# EAGLE design untitled (EAGLE 9.6.0)
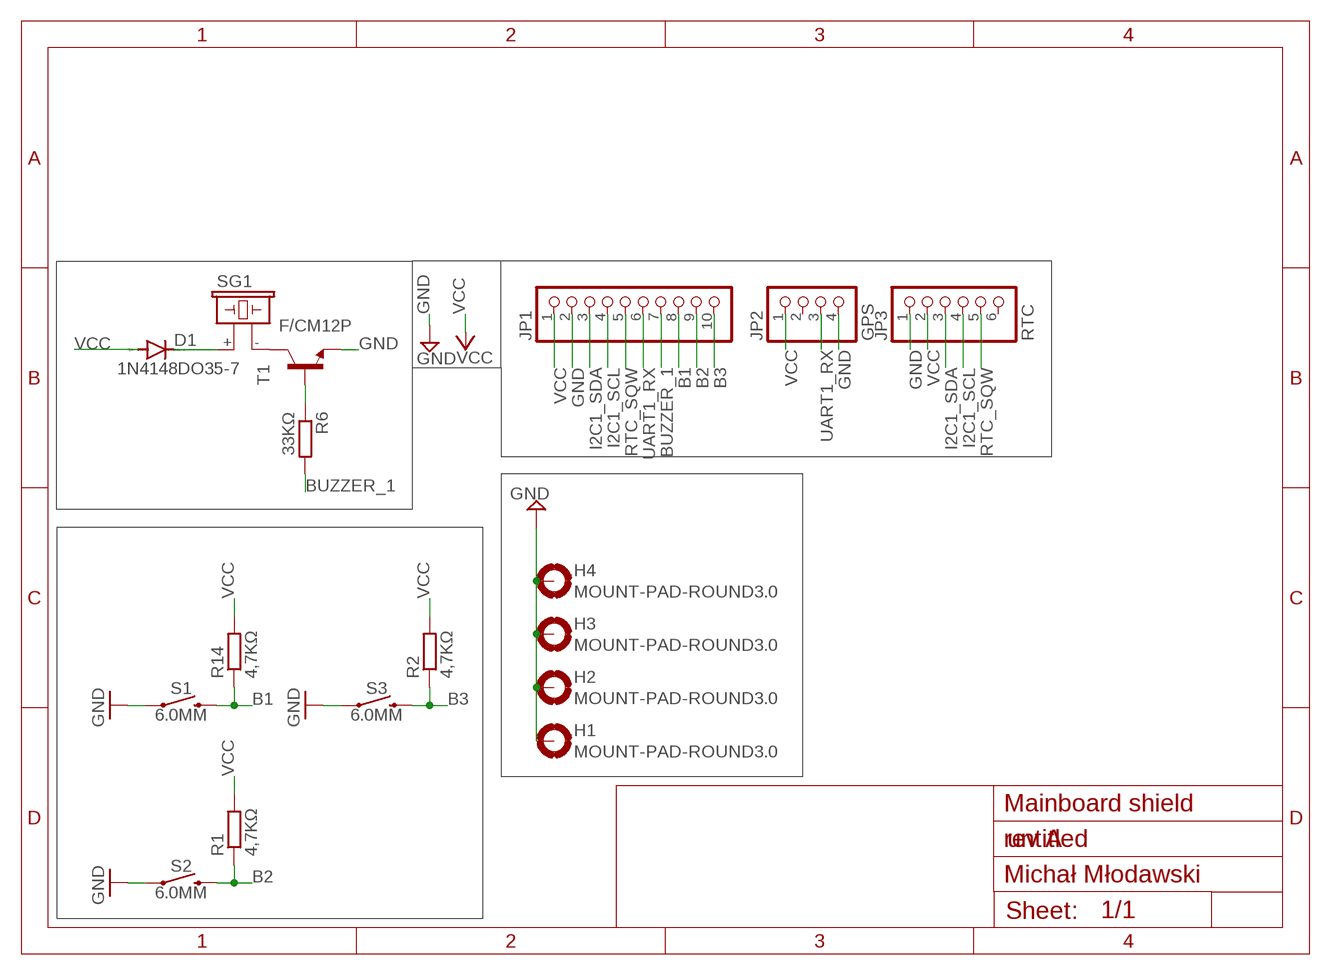
[diagram p0: schematic, sheet 1]

## Parts
D1  1N4148DO35-7  [DO35-7]
H1  MOUNT-PAD-ROUND3.0  [3,0-PAD]
H2  MOUNT-PAD-ROUND3.0  [3,0-PAD]
H3  MOUNT-PAD-ROUND3.0  [3,0-PAD]
H4  MOUNT-PAD-ROUND3.0  [3,0-PAD]
JP1  PINHD-1X10  [1X10]
JP2  GPS  PINHD-1X4  [1X04]
JP3  RTC  PINHD-1X6  [1X06]
R1  4,7KΩ  R-EU_R1206  [R1206]
R2  4,7KΩ  R-EU_R1206  [R1206]
R6  33KΩ  R-EU_R1206  [R1206]
R14  4,7KΩ  R-EU_R1206  [R1206]
S1  6.0MM  MOMENTARY-SWITCH-SPST-PTH-6.0MM  [TACTILE_SWITCH_PTH_6.0MM]
S2  6.0MM  MOMENTARY-SWITCH-SPST-PTH-6.0MM  [TACTILE_SWITCH_PTH_6.0MM]
S3  6.0MM  MOMENTARY-SWITCH-SPST-PTH-6.0MM  [TACTILE_SWITCH_PTH_6.0MM]
SG1  F/CM12P  [F/CM12P]
T1  BC548-NPN-TO92-CBE  [TO92-CBE]

## Nets
B1: JP1.8 R14.1 S1.3
B2: JP1.9 R1.1 S2.3
B3: JP1.10 R2.1 S3.3
BUZZER_1: JP1.7 R6.2
GND: H1.B3,0(MOUNT) H2.B3,0(MOUNT) H3.B3,0(MOUNT) H4.B3,0(MOUNT) JP1.2 JP2.4 JP3.1 S1.1 S2.1 S3.1 T1.E
I2C1_SCL: JP1.4 JP3.4
I2C1_SDA: JP1.3 JP3.3
N$2: D1.C SG1.+
N$3: SG1.- T1.C
N$4: R6.1 T1.B
RTC_SQW: JP1.5 JP3.5
UART1_RX: JP1.6 JP2.3
VCC: D1.A JP1.1 JP2.1 JP3.2 R1.2 R2.2 R14.2
Unconnected: JP2.2 JP3.6

## Notes on the sheet
- Mainboard shield
- rev A
- Michał Młodawski

## Library data of the parts
D1 = diode:1N4148: DIODE high speed (Philips)
H1-H4 = holes:MOUNT-PAD-ROUND: MOUNTING PAD, round
JP1 = pinhead:PINHD-1X10: PIN HEADER
JP2 = pinhead:PINHD-1X4: PIN HEADER
JP3 = pinhead:PINHD-1X6: PIN HEADER
R1 R2 R6 R14 = rcl:R-EU_: RESISTOR, European symbol; SPICEPREFIX: R
S1-S3 = SparkFun-Switches:MOMENTARY-SWITCH-SPST: Momentary Switch (Pushbutton) - SPST Normally-open (NO) SPST momentary switches (buttons, pushbuttons). Variants PTH-12MM - 12mm square, through-hole Momentary Pushbutton Switch - 12mm Square <https://www.sparkfun.com/products/9190> (COM-09190) PTH-6.0MM, PTH-6.0MM-KIT - 6.0mm square, through-hole Mini Pushbutton Switch <https://www.sparkfun.com/products/97> (COM-00097) KIT package intended for soldering kit's - only one side of pads' copper is exposed. PTH-RIGHT-ANGLE-KIT - Right-angle, through-hole Right Angle Tactile Button <https://www.sparkfun.com/products/10791> - Used on SparkFun BigTime Watch Kit <https://www.sparkfun.com/products/11734> SMD-12MM - 12mm square, surface-mount Tactile Button - SMD (12mm) <https://www.sparkfun.com/products/12993> (COM-12993) Used on SparkFun PicoBoard <https://www.sparkfun.com/products/11888> SMD-4.5MM - 4.5mm Square Trackball Switch Used on SparkFun Blackberry Trackballer Breakout <https://www.sparkfun.com/products/13169> SMD-4.6MMX2.8MM - 4.60mm x 2.80mm, surface mount Used on SparkFun SAMD21 Mini Breakout <https://www.sparkfun.com/products/13664> SMD-5.2MM, SMD-5.2-REDUNDANT - 5.2mm square, surface-mount Mini Pushbutton Switch - SMD <https://www.sparkfun.com/products/8720> (COM-08720) Used on Arduino Pro Mini <https://www.sparkfun.com/products/11114> REDUNDANT package connects both switch circuits together SMD-6.0X3.5MM - 6.0 x 3.5mm, surface mount Momentary Reset Switch SMD <https://www.sparkfun.com/products/8229> (COM-08229) SMD-6.2MM-TALL - 6.2mm square, surface mount Tactile Button - SMD (6mm) <https://www.sparkfun.com/products/12992> Used on SparkFun Digital Sandbox <https://www.sparkfun.com/products/12651> SMD-RIGHT-ANGLE - Right-angle, surface mount Used on SparkFun Block for Intel® Edison - Arduino <https://www.sparkfun.com/products/13036>; PROD_ID: SWCH-08441; SF_SKU: COM-00097
SG1 = buzzer:F/CM12P: BUZZER Source: Buerklin; OC_FARNELL: unknown; OC_NEWARK: unknown
T1 = transistor:*-NPN-: NPN Transistror BF959 corrected 2008.03.06

## Board
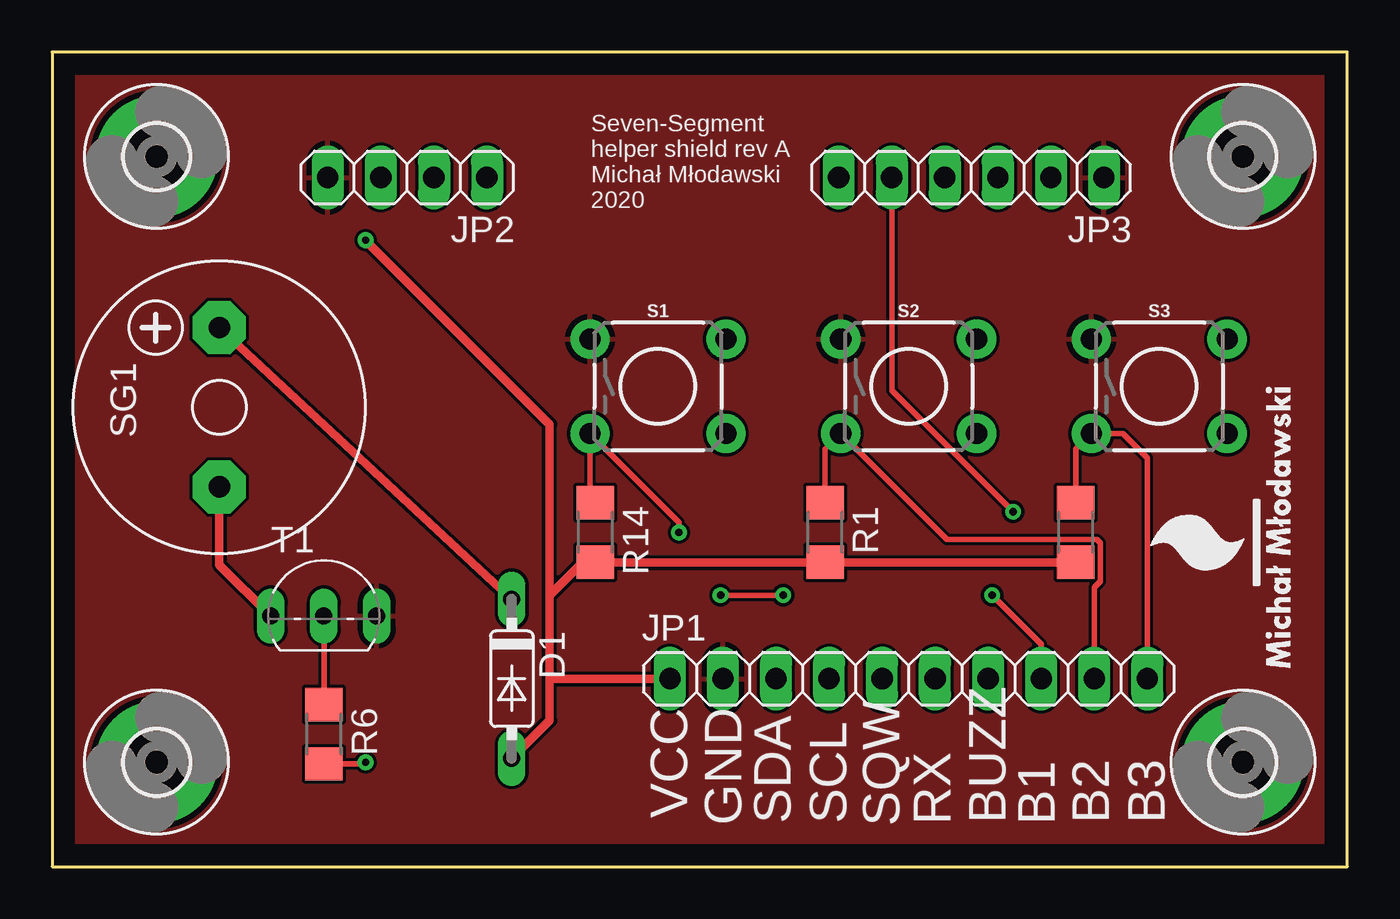
[diagram p1: board, top side]
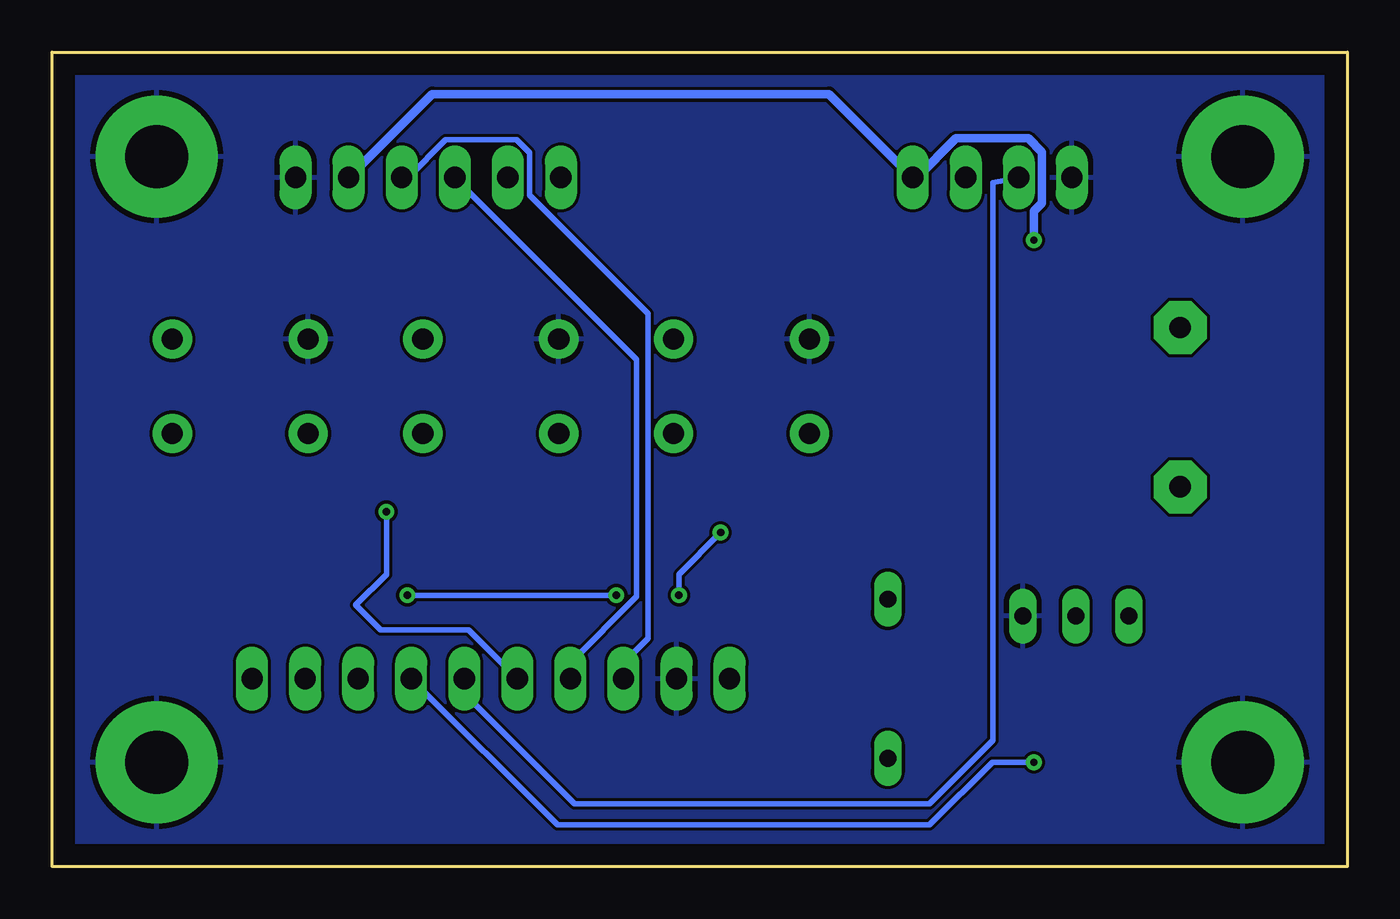
[diagram p2: board, bottom side, seen from below]

Size 62 x 39 mm. Coordinates in mm from the lower left corner, seen from the top.
Outline: 0,39 0,0 62,0 62,39 0,39
Copper layers (1*16): Top 0.035mm / dielectric 1.5mm / Bottom 0.035mm
Design rules "default": minimum track width 6mil, minimum drill 0.35mm, track to track 6mil, track to pad 6mil, pad to pad 6mil, via to via 6mil, smd to smd 6mil, copper to edge 40mil, drill to drill 6mil, minimum pad ring 10mil, minimum via ring 8mil, stop-mask expansion 4mil, vias tented up to drill 0mil, thermal gap 10mil

### Footprints (pad centres in the part's own frame; a part is rotated, then mirrored left to right if it is on the bottom)
DO35-7 = drill 0.813 long: A 3.81,0; C -3.81,0
3,0-PAD = drill 3 pad 5.842: B3,0 0,0
1X10 = drill 1.016 long: 1 -11.43,0; 2 -8.89,0; 3 -6.35,0; 4 -3.81,0; 5 -1.27,0; 6 1.27,0; 7 3.81,0; 8 6.35,0; 9 8.89,0; 10 11.43,0
1X04 = drill 1.016 long: 1 -3.81,0; 2 -1.27,0; 3 1.27,0; 4 3.81,0
1X06 = drill 1.016 long: 1 -6.35,0; 2 -3.81,0; 3 -1.27,0; 4 1.27,0; 5 3.81,0; 6 6.35,0
R1206 = smd 1.6 x 1.803: 1 -1.422,0; 2 1.422,0
TACTILE_SWITCH_PTH_6.0MM = drill 1.016 pad 1.88: 1 -3.251,2.261; 2 3.251,2.261; 3 -3.251,-2.261; 4 3.251,-2.261
F/CM12P = drill 1.016 pad 2.54 octagon: + 3.81,0; - -3.81,0
TO92-CBE = drill 0.813 long: B 0,0; C -2.54,0; E 2.54,0

### Placement (x,y rotation side)
D1  22,9 270 top
H1  5,34 0 top
H2  5,5 0 top
H3  57,5 0 top
H4  57,34 0 top
JP1  41,9 0 top
JP2  17,33 180 top
JP3  44,33 180 top
R1  37,16 270 top
R2  49,16 270 top
R6  13.01,6.35 270 top
R14  26,16 270 top
S1  29,23 0 top
S2  41,23 0 top
S3  53,23 0 top
SG1  8,22 90 top
T1  13,12 0 top

### Tracks (layer width: path | path; a pad name or v marks a point on that pad's centre or on a via)
B1  (via drill 0.35)
  Top 0.254: R14.1 25.75,17.67 S1.3 30,16.49 v30,16 | v32,13 v35,13 | v45,13 47.35,10.65 JP1.8
  Bottom 0.254: v30,16 32,14 v32,13 | v35,13 v45,13
B2
  Top 0.254: JP1.9 49.89,13.37 50.18,13.66 50.18,15.49 50.02,15.66 42.83,15.66 S2.3 37,19.99 R1.1
B3
  Top 0.254: JP1.10 52.43,19.57 51.26,20.74 S3.3 49,19.99 R2.1
BUZZER_1  (via drill 0.35)
  Top 0.254: v15,5 14.92,4.92 R6.2
  Bottom 0.254: JP1.7 37.81,2 20,2 17,5 v15,5
GND
  pour Top: 0,39 0,0 62,0 62,39
  pour Bottom: 0,39 0,0 62,0 62,39
I2C1_SCL
  Bottom 0.254: JP1.4 37.19,9.76 34.02,12.93 34.02,19 34.02,24.29 JP3.4
I2C1_SDA
  Bottom 0.254: JP1.3 34.65,9.76 33.48,10.93 33.48,26 33.48,26.48 39.15,32.15 39.15,34.19 39.76,34.8 43.16,34.8 44.97,33 JP3.3
N$2
  Top 0.406: SG1.+ 21.81,13 D1.C
N$3
  Top 0.406: SG1.- 8,14.46 T1.C
N$4
  Top 0.254: T1.B 13.01,11.99 R6.1
RTC_SQW  (via drill 0.35)
  Top 0.254: JP3.5 40.19,22.81 v46,17
  Bottom 0.254: JP1.5 42.07,11.34 46.27,11.34 47.47,12.54 46,14 v46,17
UART1_RX
  Bottom 0.254: JP1.6 42.27,8.27 37,3 20,3 16.96,6.04 16.96,32.74 JP2.3
VCC  (via drill 0.35)
  Top 0.406: D1.A 23.81,7 23.81,9 | 23.81,9 JP1.1 | R2.2 R1.2 R14.2 25.39,14.58 23.81,13 | 23.81,9 23.81,13 | 23.81,13 23.81,21.18 v15,29.99 v15,30
  Bottom 0.406: JP3.2 43.81,37 24.81,37 JP2.1 20.61,33 18.73,34.88 15.27,34.88 14.61,34.23 14.61,31.77 15,31.39 v15,30

### Text on the board
tPlace: Seven-Segment / helper shield rev A / Michał Młodawski / 2020 | VCC | GND | SDA | SCL | SQW | RX | BUZZ | B1 | B2 | B3